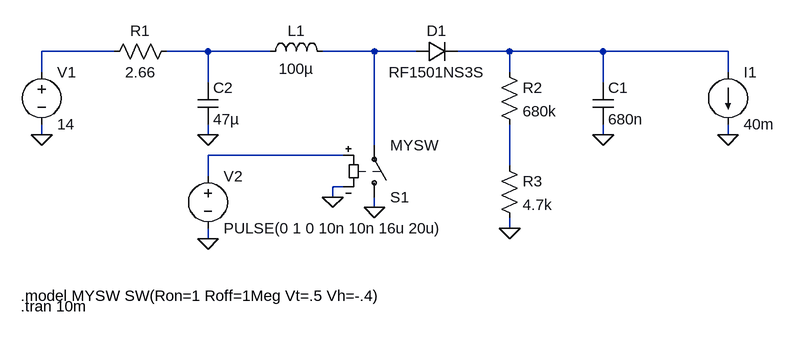
[diagram p0: schematic B+ Boost.asc]
B+ Boost.asc, the LTspice schematic file:
Version 4
SHEET 1 896 680
WIRE -128 -432 -240 -432
WIRE 16 -432 -48 -432
WIRE 112 -432 16 -432
WIRE 272 -432 192 -432
WIRE 336 -432 272 -432
WIRE 480 -432 400 -432
WIRE 624 -432 480 -432
WIRE 816 -432 624 -432
WIRE -240 -400 -240 -432
WIRE 480 -400 480 -432
WIRE 816 -400 816 -432
WIRE 16 -384 16 -432
WIRE 624 -384 624 -432
WIRE -240 -304 -240 -320
WIRE 16 -304 16 -320
WIRE 624 -304 624 -320
WIRE 816 -304 816 -320
WIRE 272 -288 272 -432
WIRE 224 -272 16 -272
WIRE 480 -256 480 -320
WIRE 16 -240 16 -272
WIRE 224 -224 208 -224
WIRE 208 -208 208 -224
WIRE 272 -192 272 -208
WIRE 480 -160 480 -176
WIRE 16 -144 16 -160
FLAG 208 -208 0
FLAG 16 -144 0
FLAG 480 -160 0
FLAG 624 -304 0
FLAG 816 -304 0
FLAG -240 -304 0
FLAG 272 -192 0
FLAG 16 -304 0
SYMBOL ind 96 -416 R270
WINDOW 0 32 56 VTop 2
WINDOW 3 5 56 VBottom 2
SYMATTR InstName L1
SYMATTR Value 100µ
SYMBOL res -32 -448 R90
WINDOW 0 0 56 VBottom 2
WINDOW 3 32 56 VTop 2
SYMATTR InstName R1
SYMATTR Value 2.66
SYMBOL diode 336 -416 R270
WINDOW 0 32 32 VTop 2
WINDOW 3 0 32 VBottom 2
SYMATTR InstName D1
SYMATTR Value RF1501NS3S
SYMBOL res 464 -416 R0
SYMATTR InstName R2
SYMATTR Value 680k
SYMBOL res 464 -272 R0
SYMATTR InstName R3
SYMATTR Value 4.7k
SYMBOL cap 608 -384 R0
SYMATTR InstName C1
SYMATTR Value 680n
SYMBOL current 816 -400 R0
WINDOW 123 0 0 Left 0
WINDOW 39 0 0 Left 0
SYMATTR InstName I1
SYMATTR Value 40m
SYMBOL voltage -240 -416 R0
WINDOW 123 0 0 Left 0
WINDOW 39 0 0 Left 0
SYMATTR InstName V1
SYMATTR Value 14
SYMBOL sw 272 -192 M180
SYMATTR InstName S1
SYMATTR Value MYSW
SYMBOL voltage 16 -256 R0
WINDOW 123 0 0 Left 0
WINDOW 39 0 0 Left 0
SYMATTR InstName V2
SYMATTR Value PULSE(0 1 0 10n 10n 16u 20u)
SYMBOL cap 0 -384 R0
SYMATTR InstName C2
SYMATTR Value 47µ
TEXT -272 -56 Left 2 !.model MYSW SW(Ron=1 Roff=1Meg Vt=.5 Vh=-.4)
TEXT -272 -40 Left 2 !.tran 10m

The netlist it stands for:
* B+ Boost.asc
L1 N002 N003 100µ
R1 N002 N001 2.66
D1 N003 N004 RF1501NS3S
R2 N004 N006 680k
R3 N006 0 4.7k
C1 N004 0 680n
I1 N004 0 40m
V1 N001 0 14
S1 0 N003 N005 0 MYSW
V2 N005 0 PULSE(0 1 0 10n 10n 16u 20u)
C2 N002 0 47µ
.model D D
.lib standard.dio
.model MYSW SW(Ron=1 Roff=1Meg Vt=.5 Vh=-.4)
.tran 10m
.backanno
.end